# Altium schematic sheet Gecko.SchDoc: Gecko
size A4; Organization: Gateway; Address1: University of Colorado; Address2: Boulder; DocumentNumber: 4; Revision: 1; SheetNumber: 4; SheetTotal: 6
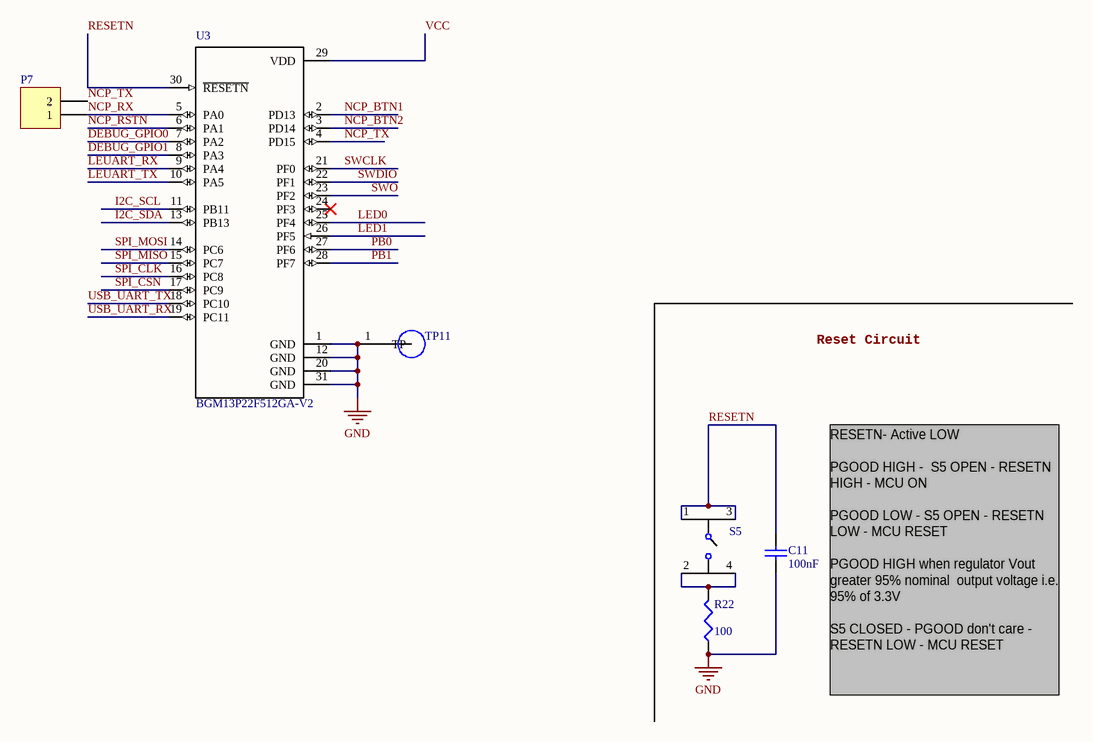
[diagram p0: Gecko.SchDoc]

## Parts
C11  value 100nF  [1608[0603]]  (hidden comment: CL10F104ZO8NNNC)
P7  Header 2  [HDR1X2]  (value not drawn)
R22  value 100  [1608[0603]]  (hidden comment: CRCW0603100RJNEAC)
S5  430182043816  [430182043816]  (value not drawn)
TP11  5019  [TP380X203]  (value not drawn)
U3  BGM13P22F512GA-V2  [MODULE_BGM13P22F512GA-V2]

## Nets
GND: C11.2 R22.1 TP11.1(TP) U3.1(GND) U3.12(GND) U3.20(GND) U3.31(GND)
DEBUG_GPIO0: U3.7(PA2)
DEBUG_GPIO1: U3.8(PA3)
I2C_SCL: U3.11(PB11)
I2C_SDA: U3.13(PB13)
LED0: U3.25(PF4)
LED1: U3.26(PF5)
LEUART_RX: U3.9(PA4)
LEUART_TX: U3.10(PA5)
NCP_BTN1: U3.2(PD13)
NCP_BTN2: U3.3(PD14)
NCP_RSTN: U3.6(PA1)
NCP_RX: P7.1 U3.5(PA0)
NCP_TX: P7.2 U3.4(PD15)
PB0: U3.27(PF6)
PB1: U3.28(PF7)
RESETN: C11.1 S5.1 S5.3 U3.30(~{RESETN})
SPI_CLK: U3.16(PC8)
SPI_CSN: U3.17(PC9)
SPI_MISO: U3.15(PC7)
SPI_MOSI: U3.14(PC6)
SWCLK: U3.21(PF0)
SWDIO: U3.22(PF1)
SWO: U3.23(PF2)
USB_UART_RX: U3.19(PC11)
USB_UART_TX: U3.18(PC10)
VCC: U3.29(VDD)
NetR22_2: R22.2 S5.2 S5.4

Not connected (* = marked no-connect by the designer): U3 24(PF3)*

## Notes on the sheet
- Reset Circuit
- RESETN- Active LOW
  PGOOD HIGH -  S5 OPEN - RESETN HIGH - MCU ON
  PGOOD LOW - S5 OPEN - RESETN LOW - MCU RESET
  PGOOD HIGH when regulator Vout greater 95% nominal  output voltage i.e. 95% of 3.3V
  S5 CLOSED - PGOOD don't care - RESETN LOW - MCU RESET
- Title
- Size:
- Date:
- A4
- Number:
- Time:
- Revision:
- Sheet
- of
- File:

## Library data of the parts
C11 = Cap: CAP CER 0.1UF 16V X7R 0603; Manufacturer: Samsung Electro-Mechanics; Published: 8-Jun-2000; LatestRevisionDate: 17-Jul-2002; LatestRevisionNote: Re-released for DXP Platform.; PackageReference: RAD-0.3; Publisher: Altium Limited; PackageDescription: Radial Cap, Thru-Hole; 2 Leads; 0.3 in Pin Spacing; Digi-Key Part Number: 1276-1258-1-ND; Manufacturer Part Number: CL10F104ZO8NNNC; ComponentLink1Description: Digi-Key Link; ComponentLink1URL: https://www.digikey.com/product-detail/en/samsung-electro-mechanics/CL10F104ZO8NNNC/1276-1258-1-ND/3889344
P7 = Header 2: Header, 2-Pin; LatestRevisionDate: 17-Jul-2002; LatestRevisionNote: Re-released for DXP Platform.; Publisher: Altium Limited
R22 = Res3: RES SMD 100 OHM 5% 1/10W 0603; Manufacturer: Vishay Dale; Published: 8-Jun-2000; LatestRevisionDate: 29-May-2009; LatestRevisionNote: IPC-7351 Footprint Added.; PackageReference: J1-0603; Publisher: Altium Limited; PackageDescription: Chip Resistor; Digi-Key Part Number: 541-4059-1-ND; Manufacturer Part Number: CRCW0603100RJNEAC; ComponentLink1URL: https://www.digikey.com/product-detail/en/vishay-dale/CRCW0603100RJNEAC/541-4059-1-ND/7928742; ComponentLink1Description: Digi-Key Link
S5 = 430182043816: SWITCH TACTILE SPST-NO 0.05A 12V; Manufacturer: Wurth Electronics; Manufacturer Part Number: 430182043816; Value: *; Digi-Key Part Number: 732-7004-1-ND; ComponentLink1URL: https://www.digikey.com/products/en/switches/tactile-switches/197?k=430+182+043+816&k=&pkeyword=430+182+043+816&pv7=2&sf=0&quantity=&ColumnSort=0&page=1&pageSize=25; ComponentLink1Description: Digi-Key Link
TP11 = 5019: PC TEST POINT MINIATURE; Manufacturer: Keystone Electronics; MF: Keystone; MP: 5019; Package: 2010 Keystone; Digi-Key_Part_Number: 36-5019CT-ND; Digi-Key_Purchase_URL: https://www.digikey.com/product-detail/en/keystone-electronics/5019/36-5019CT-ND/3907344?utm_source=snapeda&utm_medium=aggregator&utm_campaign=symbol; SnapEDA_Link: https://www.snapeda.com/parts/5019/Keystone%20Electronics/view-part/?ref=snap; Value: *; ComponentLink1Description: Digi-Key Link; ComponentLink1URL: https://www.digikey.com/product-detail/en/keystone-electronics/5019/36-5019CT-ND/3907344?utm_source=snapeda&utm_medium=aggregator&utm_campaign=symbol; Digi-Key Part Number: 36-5019CT-ND; Manufacturer Part Number: 5019
U3 = BGM13P22F512GA-V2: EFR32BG13 Bluetooth 5.0 Module, 512kB Flash, +8dbm; Manufacturer: Silicon Labs; Price: None; Package: Module Silicon Labs; SnapEDA_Link: https://www.snapeda.com/parts/BGM13P22F512GA-V2/Silicon%20Labs/view-part/?ref=snap; Availability: Available; Manufacturer Part Number: BGM13P22F512GA-V2; Value: *; Digi-Key Part Number: 336-5465-1-ND; ComponentLink1URL: https://www.digikey.com/product-detail/en/silicon-labs/BGM13P32F512GA-V2R/336-5465-1-ND/9324917; ComponentLink1Description: Digi-Key Link